# Altium schematic sheet Sheet2.SCHDOC
size 209 x 297 mm; SheetNumber: 1; SheetTotal: 2; DocumentName: Sheet2.SCHDOC
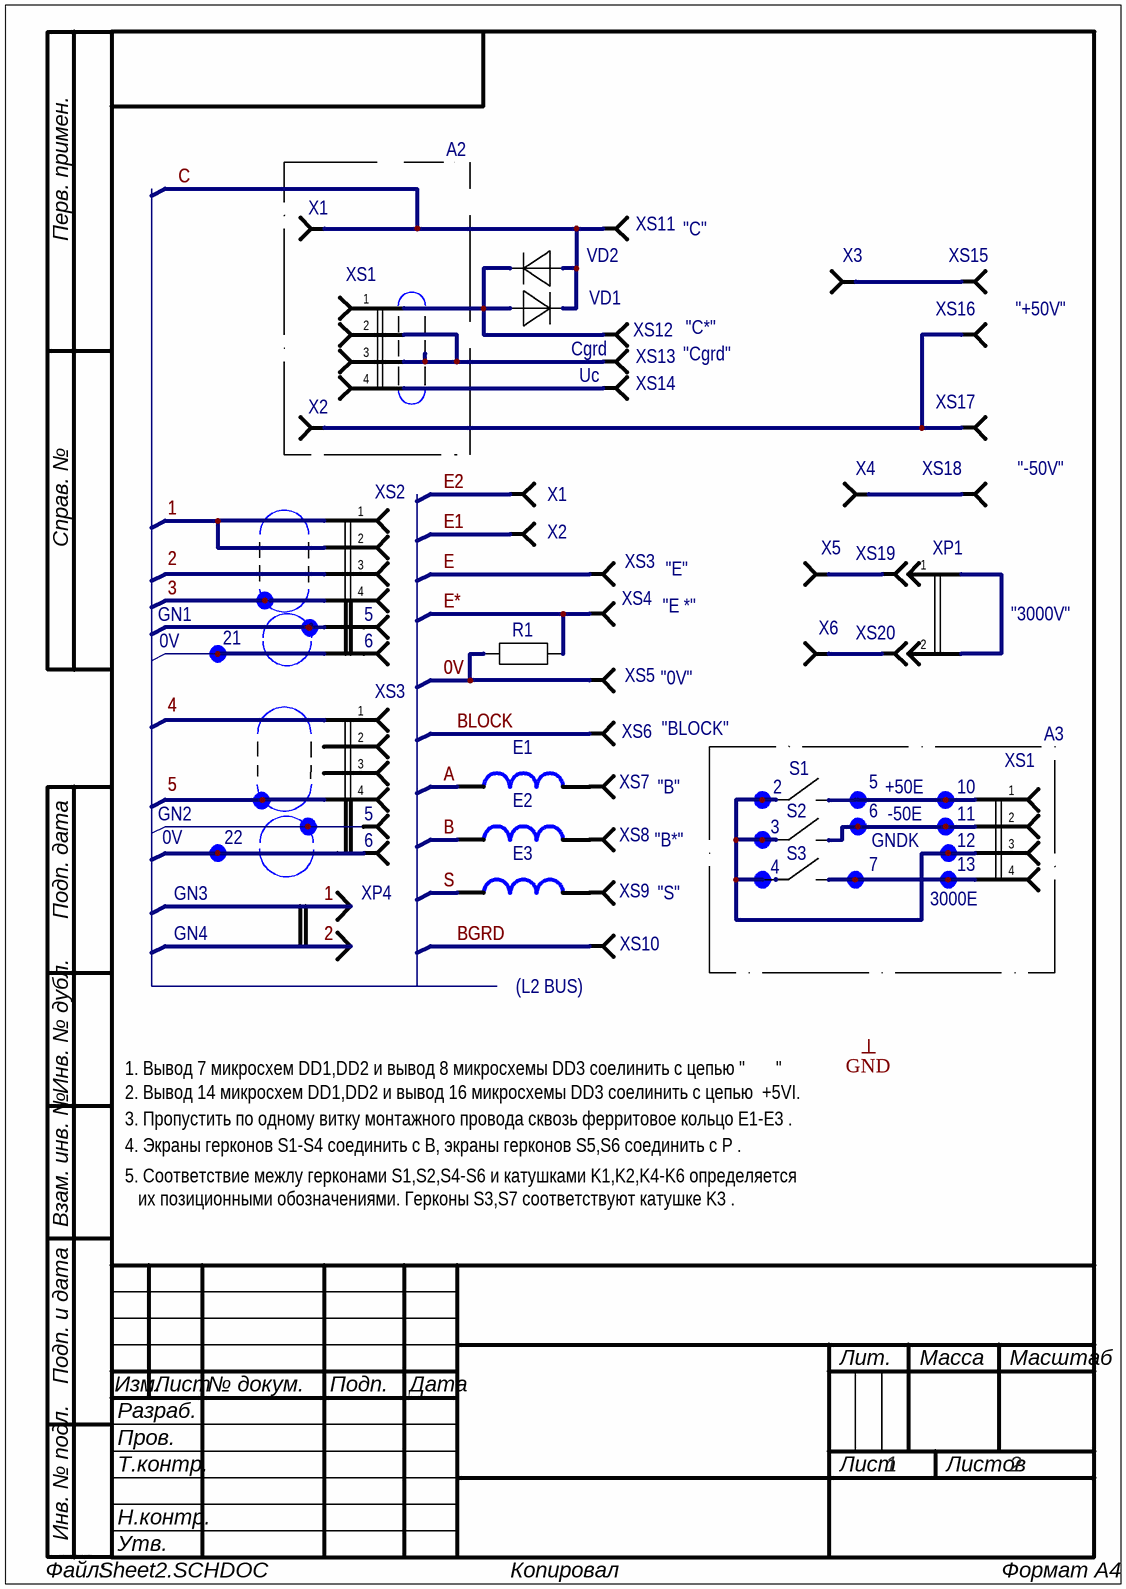
[diagram p0: Sheet2.SCHDOC]

## Parts
100  ТОЧКА ПАЙКИ  [LEPESTOK7_750_224]  (value not drawn)
E1  КОЛЬЦО ФЕРРИТОВОЕ M2000HM-39 R  (value not drawn)
E2  КОЛЬЦО ФЕРРИТОВОЕ M2000HM-39 R  (value not drawn)
E3  КОЛЬЦО ФЕРРИТОВОЕ M2000HM-39 R  (value not drawn)
R120  С2-33Н-0,5-100 ОМ+-5%-А-Г-В  (value not drawn)
S9  МИКРОПЕРЕКЛЮЧАТЕЛЬ MSS-10-10  (value not drawn)
S10  МИКРОПЕРЕКЛЮЧАТЕЛЬ MSS-10-10  (value not drawn)
S`  МИКРОПЕРЕКЛЮЧАТЕЛЬ MSS-10-10  (value not drawn)
T1  ТОЧКА ПАЙКИ  [LEPESTOK7_750_224]  (value not drawn)
T5  ТОЧКА ПАЙКИ  [LEPESTOK7_750_224]  (value not drawn)
T6  ТОЧКА ПАЙКИ  [LEPESTOK7_750_224]  (value not drawn)
T8  ТОЧКА ПАЙКИ  [LEPESTOK7_750_224]  (value not drawn)
T9  ТОЧКА ПАЙКИ  [LEPESTOK7_750_224]  (value not drawn)
T10  ТОЧКА ПАЙКИ  [LEPESTOK7_750_224]  (value not drawn)
T11  ТОЧКА ПАЙКИ  [LEPESTOK7_750_224]  (value not drawn)
T12  ТОЧКА ПАЙКИ  [LEPESTOK7_750_224]  (value not drawn)
T13  ТОЧКА ПАЙКИ  [LEPESTOK7_750_224]  (value not drawn)
T14  ТОЧКА ПАЙКИ  [LEPESTOK7_750_224]  (value not drawn)
T15  ТОЧКА ПАЙКИ  [LEPESTOK7_750_224]  (value not drawn)
T16  ТОЧКА ПАЙКИ  [LEPESTOK7_750_224]  (value not drawn)
T17  ТОЧКА ПАЙКИ  [LEPESTOK7_750_224]  (value not drawn)
T18  ТОЧКА ПАЙКИ  [LEPESTOK7_750_224]  (value not drawn)
T19  ТОЧКА ПАЙКИ  [LEPESTOK7_750_224]  (value not drawn)
VD2  ДИОД SR804  (value not drawn)
VD120  ДИОД SR804  (value not drawn)
X1  КЛЕММА TR-3,5-4  (value not drawn)
X2  КЛЕММА TR-3,5-4  (value not drawn)
X3  КЛЕММА TR-3,5-4  (value not drawn)
X4  КЛЕММА TR-3,5-4  (value not drawn)
X5  КЛЕММА TR-3,5-4  (value not drawn)
X6  КЛЕММА TR-3,5-4  (value not drawn)
X7  КЛЕММА TR-3,5-4  (value not drawn)
X8  КЛЕММА TR-3,5-4  (value not drawn)
XP1  ПЕРЕКЛЮЧАТЕЛЬ УШЯИ.685522.007  (value not drawn)
XS1  РОЗЕТКА AMPMODU 0-0280359-0  (value not drawn)
XS2  РОЗЕТКА AMPMODU 0-0280359-0  (value not drawn)
XS3  РОЗЕТКА SEB 2610-F4.8 (BLACK)  (value not drawn)
XS4  РОЗЕТКА SEB 2610-F4.8 (BLACK)  (value not drawn)
XS5  РОЗЕТКА SEB 2610-F4.8 (BLACK)  (value not drawn)
XS6  РОЗЕТКА SEB 2610-F4.8 (BLACK)  (value not drawn)
XS7  РОЗЕТКА SEB 2610-F4.8 (YELLOW)  (value not drawn)
XS8  РОЗЕТКА SEB 2610-F4.8 (YELLOW)  (value not drawn)
XS9  РОЗЕТКА SEB 2610-F4.8 (GREEN)  (value not drawn)
XS10  РОЗЕТКА SEB 2610-F4.8 (YELLOW)  (value not drawn)
XS11  РОЗЕТКА SEB 2610-F4.8 (RED)  (value not drawn)
XS12  РОЗЕТКА SEB 2610-F4.8 (RED)  (value not drawn)
XS13  РОЗЕТКА SEB 2610-F4.8 (RED)  (value not drawn)
XS14  РОЗЕТКА SEB 2610-F4.8 (RED)  (value not drawn)
XS16  РОЗЕТКА SEB 2610-F4.8 (BLACK)  (value not drawn)
XS17  РОЗЕТКА SEB 2610-F4.8 (BLACK)  (value not drawn)
XS18  РОЗЕТКА SEB 2610-F4.8 (BLACK)  (value not drawn)
XS19  РОЗЕТКА SEB 2610-F4.8 (BLACK)  (value not drawn)
XS20  РОЗЕТКА SEB 2610-F4.8 (BLACK)  (value not drawn)
XS21  РОЗЕТКА SEB 2610-F4.8 (BLACK)  (value not drawn)
XS22  РОЗЕТКА AMPMODU 0-0280359-0  (value not drawn)
XS26  РОЗЕТКА SEB 2610-F4.8 (BLACK)  (value not drawn)
XS27  РОЗЕТКА SEB 2610-F4.8 (BLACK)  (value not drawn)
XS28  РОЗЕТКА SEB 2610-F4.8 (BLACK)  (value not drawn)
XS29  РОЗЕТКА SEB 2610-F4.8 (BLACK)  (value not drawn)
XS141  РОЗЕТКА AMPMODU 0-0280359-0  (value not drawn)

## Nets
0V: R120.1 XS5.1
1: XS141.1 XS141.2
3: T17.1 XS141.4
A: E1.1
B: E2.1
BGRD: XS10.1
BLOCK: XS6.1
C: VD2.1(+) VD120.2(-) X1.1 XS11.1
E: XS3.1
E1: X3.1
E2: X8.1
E*: R120.2 XS4.1
S: E3.1
Net100_1: 100.1 S9.1 S`.1 T1.1 T5.1 T8.1 XS22.3
NetE1_2: E1.2 XS7.1
NetE2_2: E2.2 XS8.1
NetE3_2: E3.2 XS9.1
NetS9_2: S9.2 T10.1 T12.1 XS22.2
NetS10_2: S10.2 T6.1 T11.1 XS22.4
NetT9_1: T9.1 T13.1 XS22.1
NetT14_1: T14.1 XS28.1
NetVD2_2: VD2.2(-) VD120.1(+) XS1.1 XS12.1
NetX2_1: X2.1 XS19.1 XS20.1
NetX4_1: X4.1 XS16.1
NetX5_1: X5.1 XS17.1
NetX6_1: X6.1 XS18.1
NetX7_1: X7.1 XS21.1
NetXP1_1: XP1.1 XP1.2
NetXS1_2: XS1.2 XS1.3 XS13.1
NetXS1_4: XS1.4 XS14.1

Not connected (* = marked no-connect by the designer): S10 1(2); S` 2(1); T15 1; T16 1; T18 1; T19 1; XS2 1 2 3 4; XS26 1(0); XS27 1(0); XS29 1(0); XS141 3

## Notes on the sheet
- A2
- "C"
- VD1
- (near X6) X3
- XS16
- (near XS18) XS15
- "+50V"
- Uc
- Cgrd
- "Cgrd"
- "C*"
- (near XS20) XS17
- (near XS141) XS2
- X2
- X1
- (near X7) X4
- (near XS21) XS18
- "-50V"
- "E"
- (near X4) X5
- XS19
- (near T16) 0V
- (near T16) GN1
- (near T16) 21
- 5
- 6
- (near R120) R1
- "E *"
- (near X5) X6
- XS20
- "3000V"
- XS3
- "0V"
- "BLOCK"
- "B"
- (near 100) 2
- S1
- (near T9) 5
- (near T9) +50E
- (near T13) 10
- (near XS22) XS1
- A3
- (near T14) 0V
- (near T14) GN2
- (near T14) 22
- "B*"
- (near T1) 3
- (near S9) S3
- (near S`) S2
- (near T10) GNDK
- -50E
- 11
- 12
- (near T14) GN3
- (near XS28) XP4
- "S"
- (near T8) 4
- (near T11) 7
- (near T6) 3000E
- 13
- GN4
- (near XS10) (L2 BUS)
- 1. Вывод 7 микросхем DD1,DD2 и вывод 8 микросхемы DD3 соелинить с цепью "       "
- 3. Пропустить по одному витку монтажного провода сквозь ферритовое кольцо E1-E3 .
- 2. Вывод 14 микросхем DD1,DD2 и вывод 16 микросхемы DD3 соелинить с цепью  +5VI.
- 4. Экраны герконов S1-S4 соединить с B, экраны герконов S5,S6 соединить с P .
- 5. Соответствие межлу герконами S1,S2,S4-S6 и катушками K1,K2,K4-K6 определяется
  их позиционными обозначениями. Герконы S3,S7 соответствуют катушке K3 .
- Labels drawn without touching a wire or pin: GND
- Перв. примен.
- Справ. №
- Подп. дата
- Инв. № дубл.
- Взам. инв. №
- Подп. и дата
- Изм.
- Разраб.
- Лист
- № докум.
- Подп.
- Дата
- Лит.
- Масса
- Масштаб
- Пров.
- Т.контр.
- Листов
- Инв. № подл.
- Н.контр.
- Утв.
- Файл:
- ALTIUM GOSTBOM2.0 KEV
- Копировал
- Формат А4

## Library data of the parts
100 T1 T5 T6 T8-T19 = ТОЧКА ПАЙКИ: Name: Точка пайки; Value: *
E1-E3 = КОЛЬЦО ФЕРРИТОВОЕ M2000HM-39 R: Name2: Кольцо ферритовое M2000HM-39 R10*6*3; Name1: Кольцо ферритовое M2000HM-39 R10*6*3
R120 = С2-33Н-0,5-100 ОМ+-5%-А-Г-В: Standart: ОЖО.467.173ТУ; Name2: С2-33Н-0,5-100 Ом+-5%-А-Г-В; Name1: С2-33Н-0,5-100 Ом+-5%-А-Г-В
S9 S10 S` = МИКРОПЕРЕКЛЮЧАТЕЛЬ MSS-10-10: Standart: Белконтмаш; Value: *; Name2: Микропереключатель MSS-10-10; Name1: Микропереключатель MSS-10-10
X1-X8 = КЛЕММА TR-3,5-4: Standart: Белконтмаш; Value: *; Name1: Клемма TR-3,5-4; Name2: Клемма TR-3,5-4
VD2 VD120 = ДИОД SR804: Value: *; Name2: Диод SR804; Name1: Диод SR804
XP1 = ПЕРЕКЛЮЧАТЕЛЬ УШЯИ.685522.007: Value: *; Name1: Переключатель УШЯИ.685522.007; Name2: Переключатель УШЯИ.685522.007
XS1 XS2 XS22 XS141 = РОЗЕТКА AMPMODU 0-0280359-0: Value: *; Name1: Розетка AMPMODU 0-0280359-0; Name2: Розетка AMPMODU 0-0280359-0
XS3-XS6 XS16-XS21 XS26-XS29 = РОЗЕТКА SEB 2610-F4.8 (BLACK): Value: *; Name1: Розетка SEB 2610-F4.8 (BLACK); Name2: Розетка SEB 2610-F4.8 (BLACK)
XS7 XS8 XS10 = РОЗЕТКА SEB 2610-F4.8 (YELLOW): Value: *; Name1: Розетка SEB 2610-F4.8 (YELLOW); Name2: Розетка SEB 2610-F4.8 (YELLOW)
XS9 = РОЗЕТКА SEB 2610-F4.8 (GREEN): Value: *; Name1: Розетка SEB 2610-F4.8 (GREEN); Name2: Розетка SEB 2610-F4.8 (GREEN)
XS11-XS14 = РОЗЕТКА SEB 2610-F4.8 (RED): Value: *; Name1: Розетка SEB 2610-F4.8 (RED); Name2: Розетка SEB 2610-F4.8 (RED)